# Altium schematic sheet measurement-ps2-hw.SchDoc
size A2; SheetNumber: 7; SheetTotal: 10
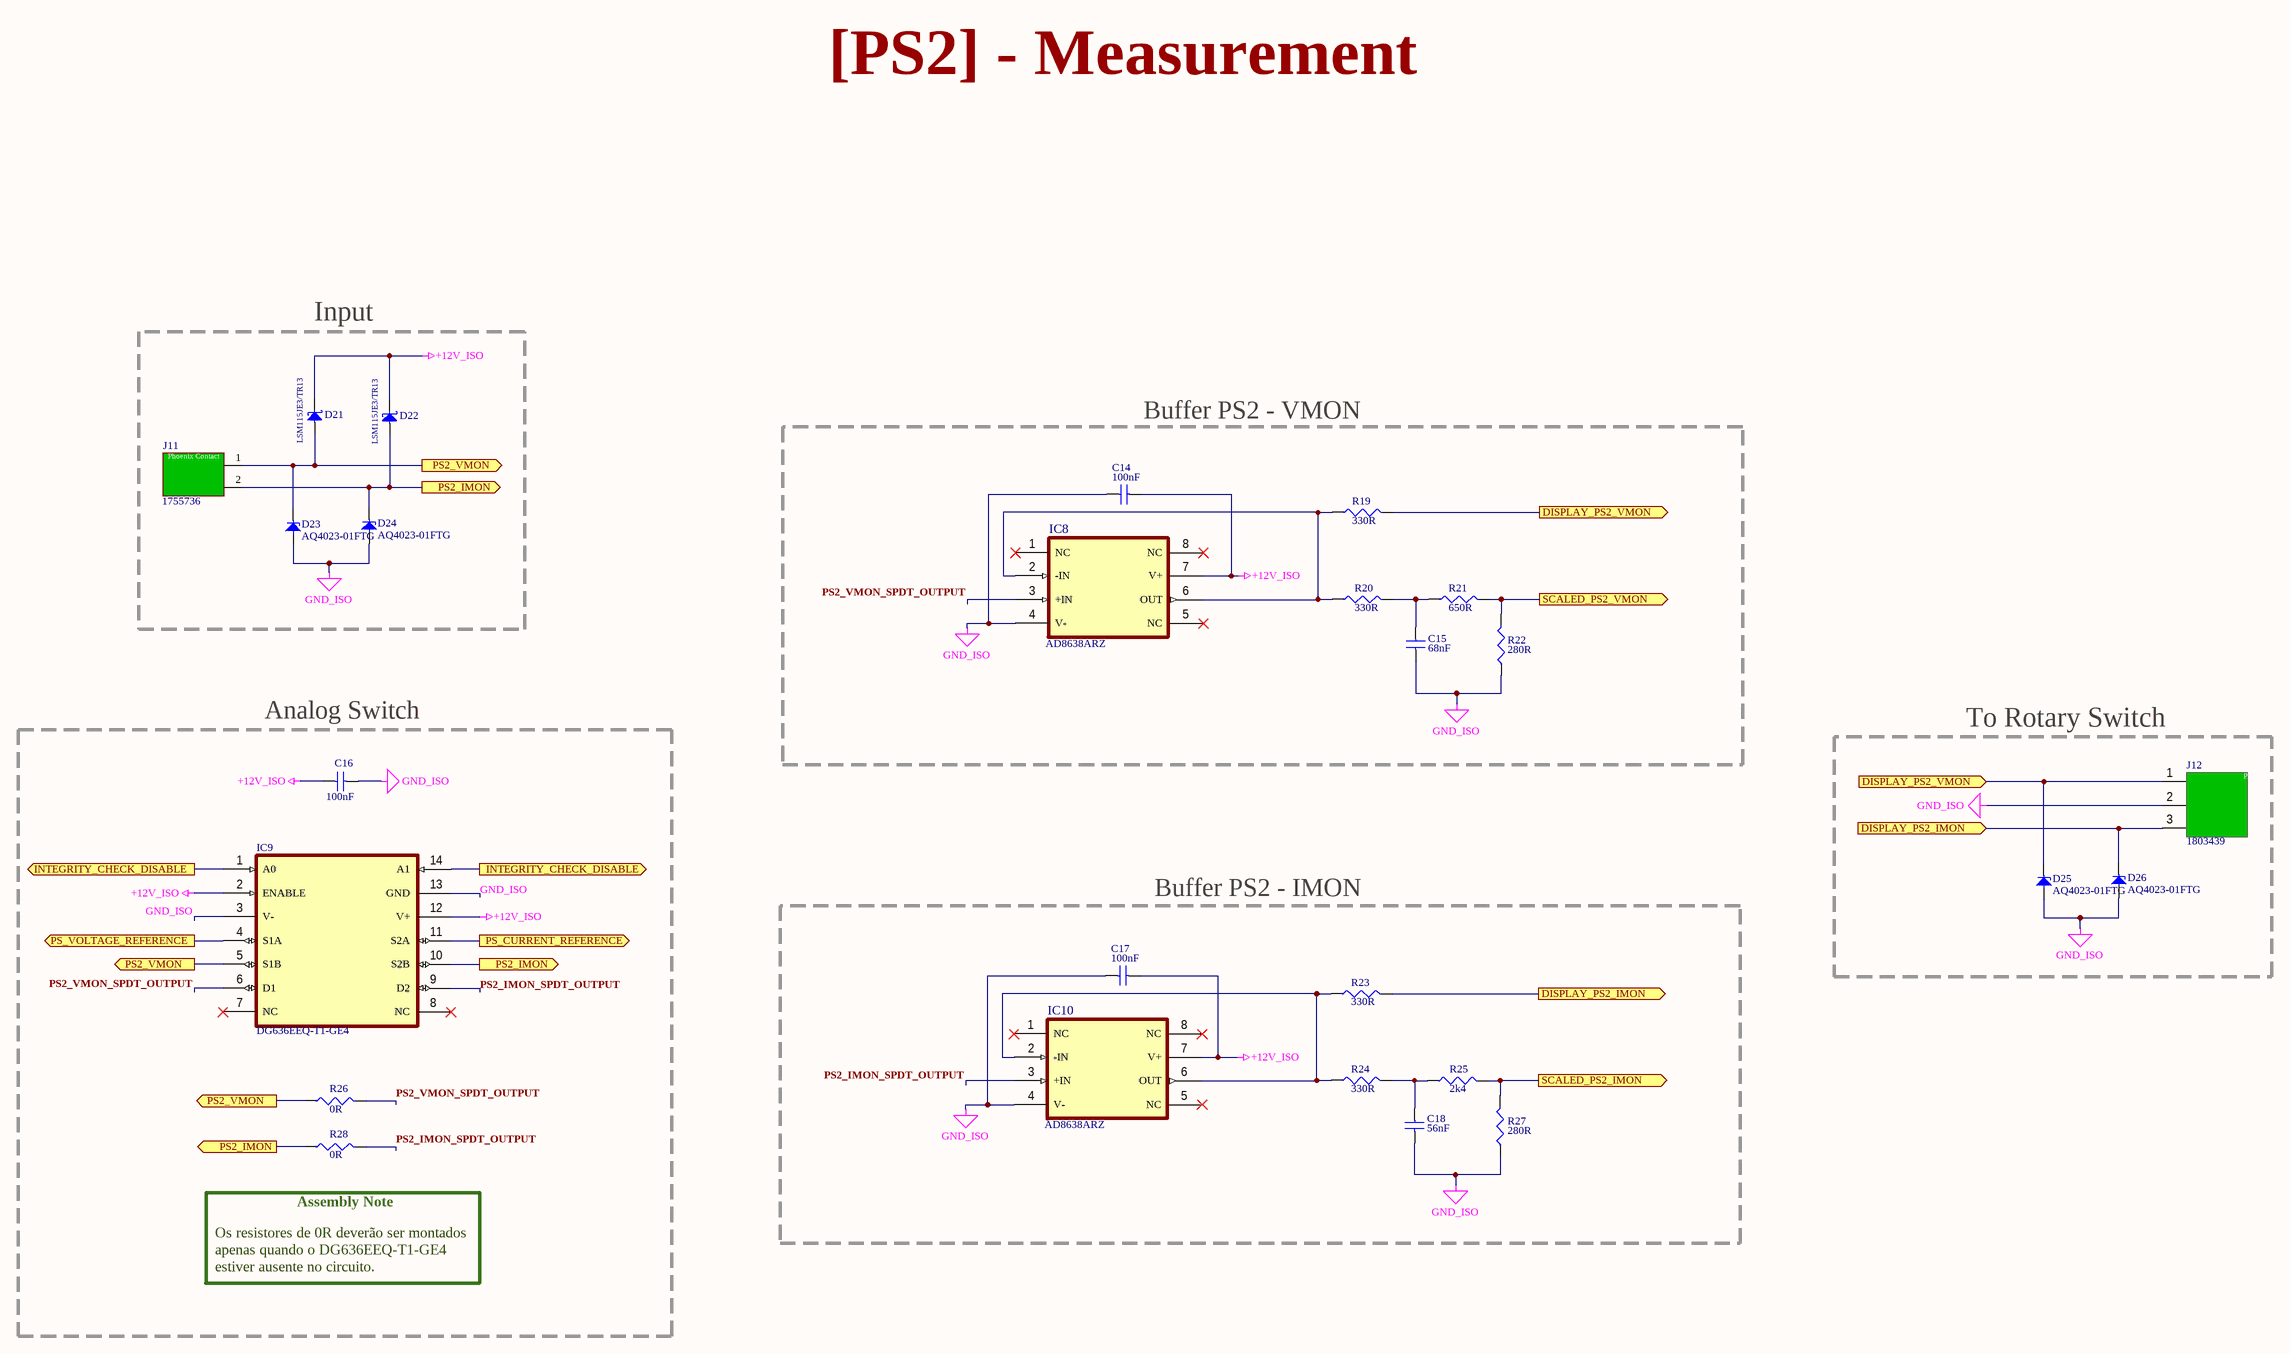
[diagram p0: measurement-ps2-hw.SchDoc]

## Parts
C14  100nF  [C0805]
C15  68nF  [C0805]
C16  100nF  [C0805]
C17  100nF  [C0805]
C18  56nF  [C0805]
D21  LSM115JE3/TR13  [DO-214BA]
D22  LSM115JE3/TR13  [DO-214BA]
D23  AQ4023-01FTG  [SOD-323]
D24  AQ4023-01FTG  [SOD-323]
D25  AQ4023-01FTG  [SOD-323]
D26  AQ4023-01FTG  [SOD-323]
IC8  AD8638ARZ  [SOIC-8]
IC9  DG636EEQ-T1-GE4  [TSSOP-14]
IC10  AD8638ARZ  [SOIC-8]
J11  1755736  [Conector 2 vias]
J12  1803439  [Conector Phoenix 3 vias]
R19  330R  [Resistor 0805]
R20  330R  [Resistor 0805]
R21  650R  [Resistor 0805]
R22  280R  [Resistor 0805]
R23  330R  [Resistor 0805]
R24  330R  [Resistor 0805]
R25  2k4  [Resistor 0805]
R26  0R  [Resistor 0805]
R27  280R  [Resistor 0805]
R28  0R  [Resistor 0805]

## Blocks framed on the sheet
Input: D21-D24 J11
Buffer PS2 - VMON: C14 C15 IC8 R19-R22
Analog Switch: C16 IC9 R26 R28
To Rotary Switch: D25 D26 J12
Buffer PS2 - IMON: C17 C18 IC10 R23-R25 R27

## Ports
DISPLAY_PS2_IMON (in, see measurement-ps2-hw[6C]), DISPLAY_PS2_IMON (out, see measurement-ps2-hw[7B]), DISPLAY_PS2_VMON (in, see measurement-ps2-hw[6B]), DISPLAY_PS2_VMON (out, see measurement-ps2-hw[7B]), INTEGRITY_CHECK_DISABLE (out, see calibration-hw[5B], measurement-output-hw[2B], measurement-output-hw[2D], measurement-output-hw[4B], measurement-output-hw[4D], measurement-ps1-hw[1C], measurement-ps1-hw[3C], measurement-ps2-hw[1B], measurement-ps3-hw[1B], measurement-ps3-hw[3B]), INTEGRITY_CHECK_DISABLE (out, see calibration-hw[5B], measurement-output-hw[2B], measurement-output-hw[2D], measurement-output-hw[4B], measurement-output-hw[4D], measurement-ps1-hw[1C], measurement-ps1-hw[3C], measurement-ps2-hw[3B], measurement-ps3-hw[1B], measurement-ps3-hw[3B]), PS2_IMON (out, see measurement-ps2-hw[2C], measurement-ps2-hw[3B]), PS2_IMON (out, see measurement-ps2-hw[2C], measurement-ps2-hw[3C]), PS2_IMON (out, see measurement-ps2-hw[3B], measurement-ps2-hw[3C]), PS2_VMON (out, see measurement-ps2-hw[2C]), PS2_VMON (out, see measurement-ps2-hw[2C], measurement-ps2-hw[3B]), PS_CURRENT_REFERENCE (out, see calibration-hw[2C], measurement-ps1-hw[3C], measurement-ps3-hw[3C]), PS_VOLTAGE_REFERENCE (out, see calibration-hw[2C], measurement-ps1-hw[1C], measurement-ps3-hw[1C]), SCALED_PS2_IMON (out, see isolated-analog-interface-hw[3B]), SCALED_PS2_VMON (out, see isolated-analog-interface-hw[3B])

## Nets
+12V_ISO: C14.2 C16.1 C17.2 D21.1(C) D22.1(C) IC8.7(V+) IC9.2(ENABLE) IC9.12(V+) IC10.7(V+)
GND_ISO: C14.1 C15.1 C16.2 C17.1 C18.1 D23.2 D24.2 D25.2 D26.2 IC8.4(V-) IC9.3(V-) IC9.13(GND) IC10.4(V-) J12.2 R22.1 R27.1
DISPLAY_PS2_IMON: D26.1 J12.3 R23.2 ; port DISPLAY_PS2_IMON
DISPLAY_PS2_VMON: D25.1 J12.1 R19.2 ; port DISPLAY_PS2_VMON
INTEGRITY_CHECK_DISABLE: IC9.1(A0) IC9.14(A1) ; port INTEGRITY_CHECK_DISABLE
PS2_IMON: D22.2(A) D24.1 IC9.10(S2B) J11.2 R28.1 ; port PS2_IMON
PS2_IMON_SPDT_OUTPUT: IC9.9(D2) IC10.3(+IN) R28.2
PS2_VMON: D21.2(A) D23.1 IC9.5(S1B) J11.1 R26.1 ; port PS2_VMON
PS2_VMON_SPDT_OUTPUT: IC8.3(+IN) IC9.6(D1) R26.2
PS_CURRENT_REFERENCE: IC9.11(S2A) ; port PS_CURRENT_REFERENCE
PS_VOLTAGE_REFERENCE: IC9.4(S1A) ; port PS_VOLTAGE_REFERENCE
SCALED_PS2_IMON: R25.2 R27.2 ; port SCALED_PS2_IMON
SCALED_PS2_VMON: R21.2 R22.2 ; port SCALED_PS2_VMON
NetC15_2: C15.2 R20.2 R21.1
NetC18_2: C18.2 R24.2 R25.1
NetIC8_2: IC8.2(-IN) IC8.6(OUT) R19.1 R20.1
NetIC10_2: IC10.2(-IN) IC10.6(OUT) R23.1 R24.1

Not connected (* = marked no-connect by the designer): IC8 1(NC)* 5(NC)* 8(NC)*; IC9 7(NC)* 8(NC)*; IC10 1(NC)* 5(NC)* 8(NC)*

## Notes on the sheet
- [PS2] - Measurement
- Assembly Note
- Os resistores de 0R deverão ser montados apenas quando o DG636EEQ-T1-GE4 estiver ausente no circuito.
- Title:
- Drawn by:
- Revision:
- Copyright CNPEM 2023.
  This documentation describes Open Hardware and is licensed under the CERN OHL S v2. You may redistribute and modify this documentation under the terms of the CERN OHL S v2. (https://www.ohwr.org/cernohl). This documentation is distributed WITHOUT ANY EXPRESS OR IMPLIED WARRANTY, INCLUDING OF MERCHANTABILITY, SATISFACTORY QUALITY AND FITNESS FOR A PARTICULAR PURPOSE. Please see the CERN OHL S v2 for applicable conditions.
- File:
- Date:
- Project:
- Time:
- Sheet
- of
- ENT - AIS - SEI
  Sistemas Eletrônicos e
  Instrumentação
- (in symbol Conector Phoenix 3 vias) Phoenix Contact
- (in symbol Phoenix 1755736) Phoenix Contact

## Library data of the parts
C14 C16 C17 = Capacitor 100nF
C15 = Capacitor 68nF
C18 = Capacitor 56nF
D21 D22 = LSM115JE3/TR13: DIODE SCHOTTKY 15V, 1A, DO214BA
D23-D26 = AQ4023-01FTG: Unidirectional TVS DIode, 12A, 1.3pF
IC8 IC10 = AD8638ARZ: 16V, Auto-Zero, Rail-to-Rail Output Operational Amplifiers
IC9 = DG636EEQ-T1-GE4: Analog Switch Dual-SPDT, 14 pins; Supplier 1: Newark; Supplier Part Number 1: 56AJ9808
J11 = Phoenix 1755736: Term Block HDR 2POS VERT 5.08MM
J12 = Conector Phoenix 3 vias
R19 R20 R23 R24 = Resistor 330R
R21 = Resistor 650R
R22 R27 = Resistor 280R
R25 = Resistor 2k4
R26 R28 = Resistor 0R - 0805: Size 0805